# Altium schematic sheet spider.SchDoc
size A3; DrawnBy: Tor Brodtkorb; SheetNumber: 1; SheetTotal: 1; Email: strawberryhacker@outlook.com; Year: 2021; Github: https://github.com/strawberryhacker
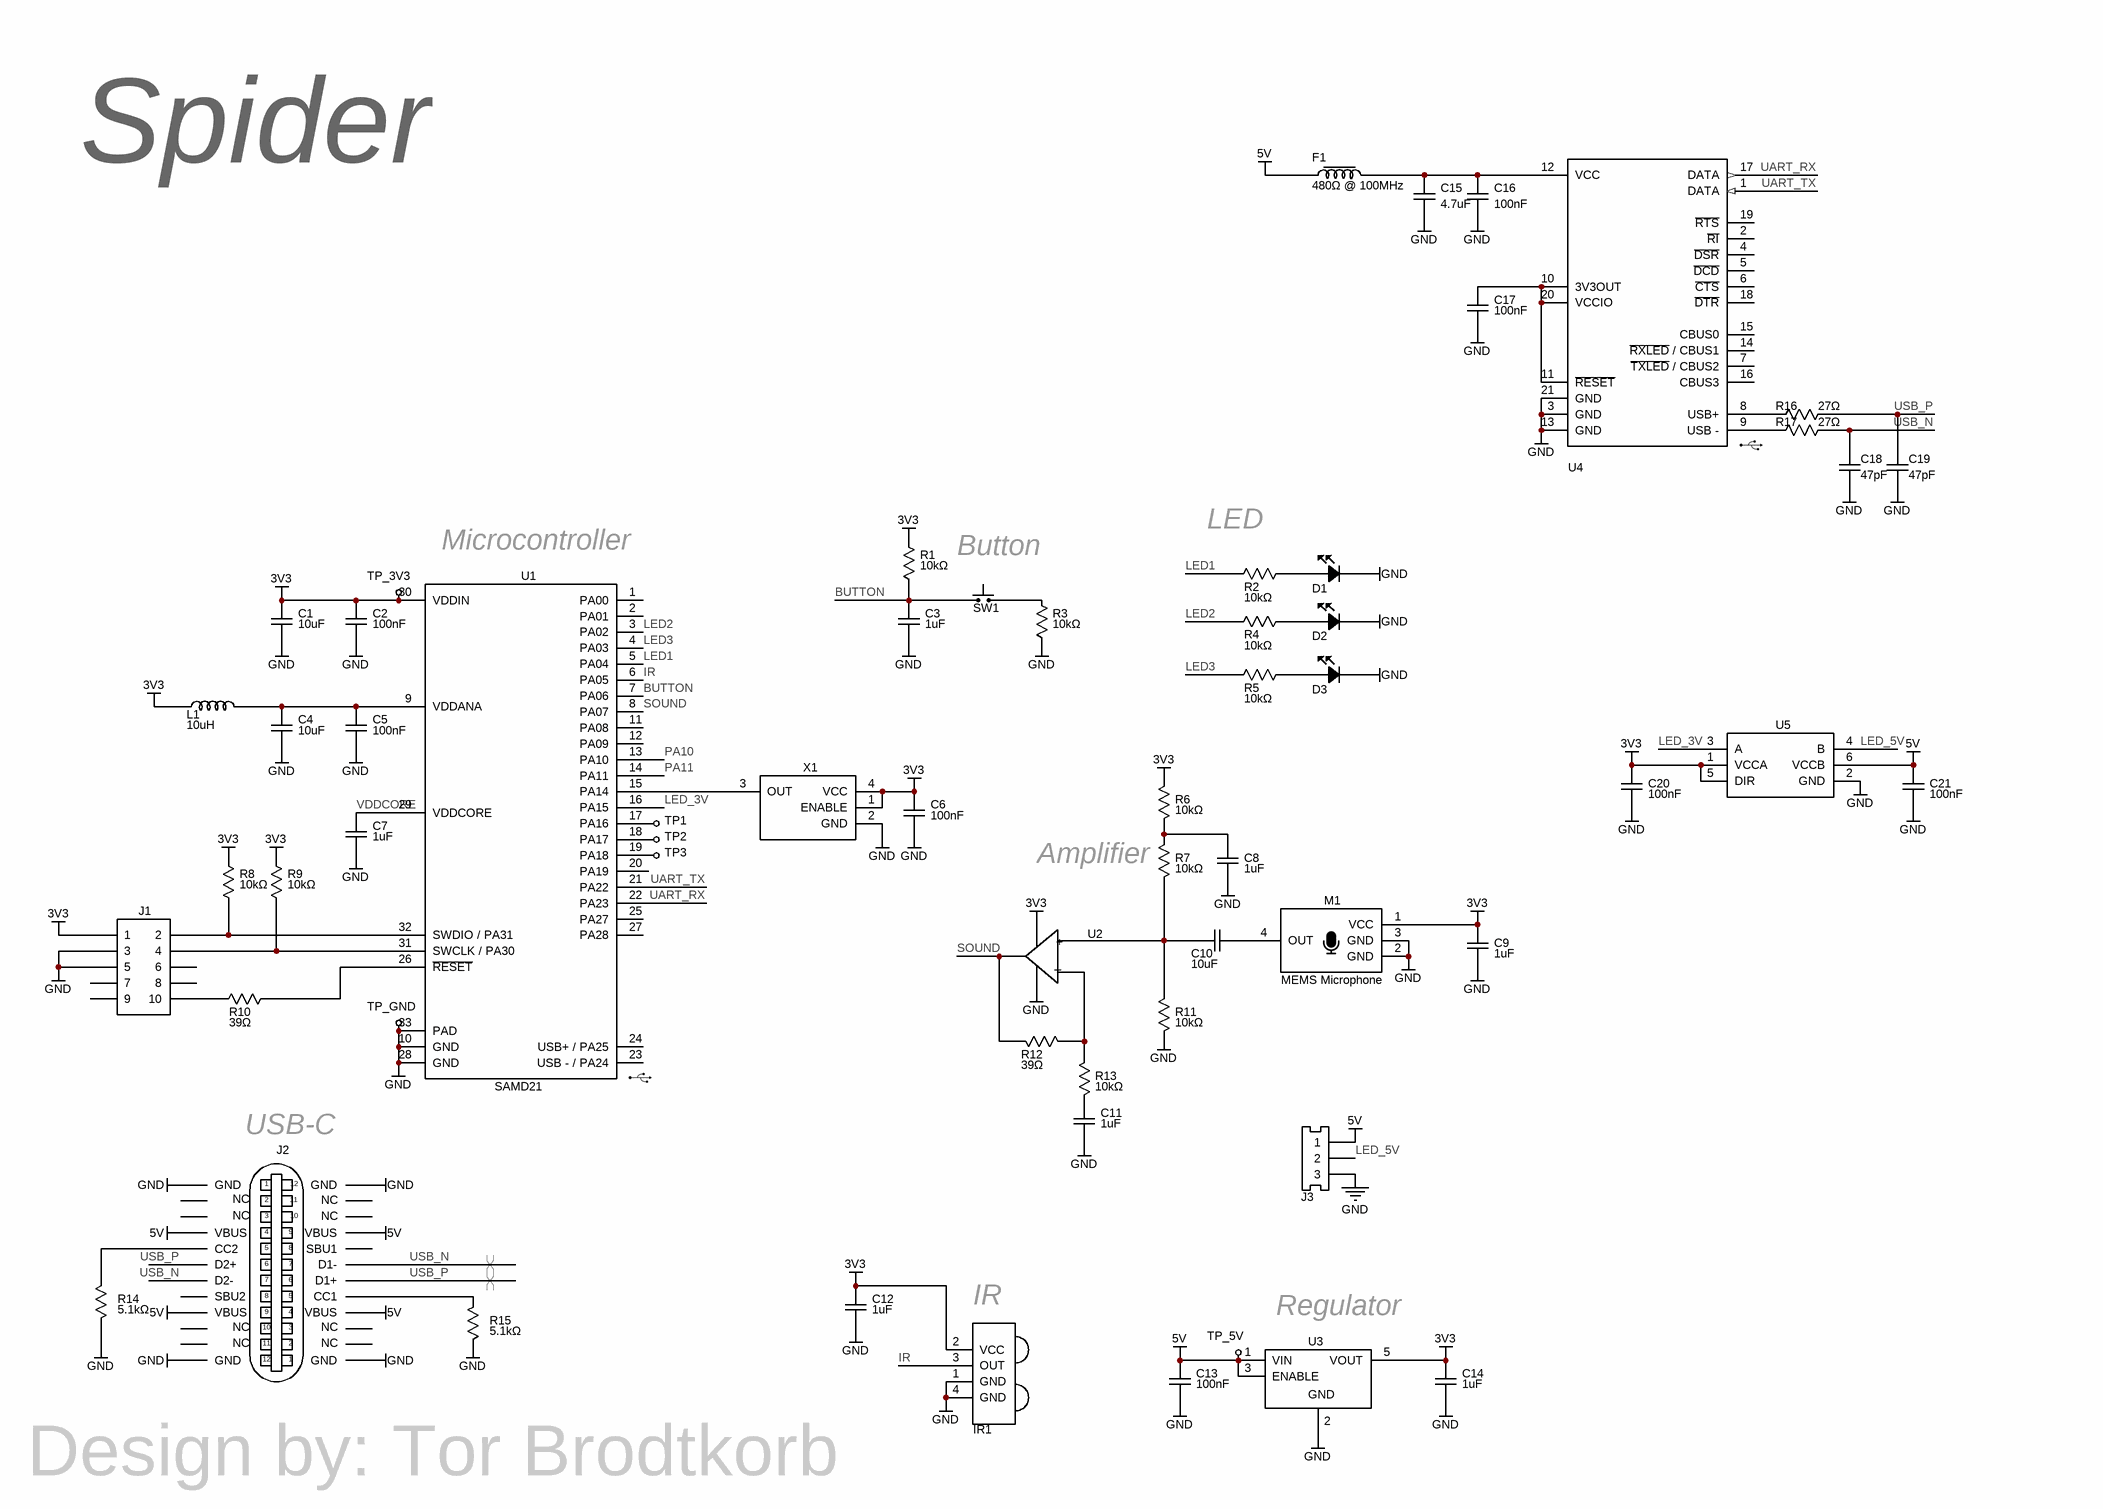
[diagram p0: spider.SchDoc]

## Parts
C1  value 10uF  [capacitor 0603]  (hidden comment: passive_5)
C2  value 100nF  [capacitor 0603]  (hidden comment: passive_5)
C3  value 1uF  [capacitor 0603]  (hidden comment: passive_5)
C4  value 10uF  [capacitor 0603]  (hidden comment: passive_5)
C5  value 100nF  [capacitor 0603]  (hidden comment: passive_5)
C6  value 100nF  [capacitor 0603]  (hidden comment: passive_5)
C7  value 1uF  [capacitor 0603]  (hidden comment: passive_5)
C8  value 1uF  [capacitor 0603]  (hidden comment: passive_5)
C9  value 1uF  [capacitor 0603]  (hidden comment: passive_5)
C10  value 10uF  [capacitor 0603]  (hidden comment: passive_5)
C11  value 1uF  [capacitor 0603]  (hidden comment: passive_5)
C12  value 1uF  [capacitor 0603]  (hidden comment: passive_5)
C13  value 100nF  [capacitor 0603]  (hidden comment: passive_5)
C14  value 1uF  [capacitor 0603]  (hidden comment: passive_5)
C15  value 4.7uF  [capacitor 0603]  (hidden comment: passive_5)
C16  value 100nF  [capacitor 0603]  (hidden comment: passive_5)
C17  value 100nF  [capacitor 0603]  (hidden comment: passive_5)
C18  value 47pF  [capacitor 0603]  (hidden comment: passive_5)
C19  value 47pF  [capacitor 0603]  (hidden comment: passive_5)
C20  value 100nF  [capacitor 0603]  (hidden comment: passive_5)
C21  value 100nF  [capacitor 0603]  (hidden comment: passive_5)
D1  LED White  [LED 0603 white]  (value not drawn)
D2  LED White  [LED 0603 white]  (value not drawn)
D3  LED White  [LED 0603 white]  (value not drawn)
F1  value 480Ω @ 100MHz  [ferrit bead 0603]  (hidden comment: passive_8)
IR1  sensor_1  [TSSP77038TR]  (value not drawn)
J1  Header 1.27mm  [header male 2x5, pitch 1.27mm]  (value not drawn)
J2  USB 2.0  [USB4105-GF-A]  (value not drawn)
J3  connector_41  [S3B-XH-A (LF)(SN)]  (value not drawn)
L1  value 10uH  [inductor 0603]  (hidden comment: passive_9)
M1  MEMS Microphone  [SPU0410HR5H-PB]
R1  value 10kΩ  [resistor 0603]  (hidden comment: passive_2)
R2  value 10kΩ  [resistor 0603]  (hidden comment: passive_2)
R3  value 10kΩ  [resistor 0603]  (hidden comment: passive_2)
R4  value 10kΩ  [resistor 0603]  (hidden comment: passive_2)
R5  value 10kΩ  [resistor 0603]  (hidden comment: passive_2)
R6  value 10kΩ  [resistor 0603]  (hidden comment: passive_2)
R7  value 10kΩ  [resistor 0603]  (hidden comment: passive_2)
R8  value 10kΩ  [resistor 0603]  (hidden comment: passive_2)
R9  value 10kΩ  [resistor 0603]  (hidden comment: passive_2)
R10  value 39Ω  [resistor 0603]  (hidden comment: passive_2)
R11  value 10kΩ  [resistor 0603]  (hidden comment: passive_2)
R12  value 39Ω  [resistor 0603]  (hidden comment: passive_2)
R13  value 10kΩ  [resistor 0603]  (hidden comment: passive_2)
R14  value 5.1kΩ  [resistor 0603]  (hidden comment: passive_2)
R15  value 5.1kΩ  [resistor 0603]  (hidden comment: passive_2)
R16  value 27Ω  [resistor 0603]  (hidden comment: passive_2)
R17  value 27Ω  [resistor 0603]  (hidden comment: passive_2)
SW1  connector_35  [KMR621NG LFS]  (value not drawn)
TP1  misc_3  [testpoint round, diameter 1.5mm]  (value not drawn)
TP2  misc_3  [testpoint round, diameter 1.5mm]  (value not drawn)
TP3  misc_3  [testpoint round, diameter 1.5mm]  (value not drawn)
TP_3V3  misc_3  [testpoint round, diameter 1.5mm]  (value not drawn)
TP_5V  misc_3  [testpoint round, diameter 1.5mm]  (value not drawn)
TP_GND  misc_3  [testpoint round, diameter 1.5mm]  (value not drawn)
U1  SAMD21  [ATSAMD21E17D-MUT]
U2  ic_6  [MCP6241T-E/OT]  (value not drawn)
U3  regulator_1  [TCR2EF33,LM(CT]  (value not drawn)
U4  FTDI  [FT231XQ-R]  (value not drawn)
U5  ic_10  [74LVC1T45Z6-7]  (value not drawn)
X1  8 MHz  [DSC6001CE2A-008.0000]  (value not drawn)

## Nets
3V3: C1.2 C2.2 C6.2 C9.2 C12.2 C14.2 C20.2 IR1.2(VCC) J1.1 L1.1 M1.1(VCC) R1.1 R6.2 R8.2 R9.2 TP_3V3.1 U1.30(VDDIN) U2.5 U3.5(VOUT) U5.1(VCCA) U5.5(DIR) X1.1(ENABLE) X1.4(VCC)
5V: C13.2 C21.2 F1.1 J2.A4_B9(VBUS) J2.B4_A9(VBUS) J3.1 TP_5V.1 U3.1(VIN) U3.3(ENABLE) U5.6(VCCB)
GND: C1.1 C2.1 C3.1 C4.1 C5.1 C6.1 C7.1 C8.1 C9.1 C11.1 C12.1 C13.1 C14.1 C15.1 C16.1 C17.1 C18.1 C19.1 C20.1 C21.1 D1.2 D2.2 D3.2 IR1.1(GND) IR1.4(GND) J1.3 J1.5 J2.A1_B12(GND) J2.B1_A12(GND) J3.3 M1.2(GND) M1.3(GND) R3.2 R11.1 R14.1 R15.1 TP_GND.1 U1.10(GND) U1.28(GND) U1.33(PAD) U2.2 U3.2 U4.3(GND) U4.13(GND) U4.21(GND) U5.2(GND) X1.2(GND)
BUTTON: C3.2 R1.2 SW1.1 U1.7(PA06)
IR: IR1.3(OUT) U1.6(PA05)
LED1: R2.2 U1.5(PA04)
LED2: R4.2 U1.3(PA02)
LED3: R5.2 U1.4(PA03)
LED_3V: U1.16(PA15) U5.3(A)
LED_5V: J3.2 U5.4(B)
PA10: U1.13(PA10)
PA11: U1.14(PA11)
SOUND: R12.2 U1.8(PA07) U2.1
UART_RX: U1.22(PA23) U4.17(DATA)
UART_TX: U1.21(PA22) U4.1(DATA)
USB_N: C18.2 J2.A7(D1-) J2.B7(D2-) R17.2
USB_P: C19.2 J2.A6(D1+) J2.B6(D2+) R16.2
VDDCORE: C7.2 U1.29(VDDCORE)
NetC4_2: C4.2 C5.2 L1.2 U1.9(VDDANA)
NetC8_2: C8.2 R6.1 R7.2
NetC10_1: C10.1 R7.1 R11.2 U2.3
NetC10_2: C10.2 M1.4(OUT)
NetC11_2: C11.2 R13.1
NetC15_2: C15.2 C16.2 F1.2 U4.12(VCC)
NetC17_2: C17.2 U4.10(3V3OUT) U4.11(~{RESET}) U4.20(VCCIO)
NetD1_1: D1.1 R2.1
NetD2_1: D2.1 R4.1
NetD3_1: D3.1 R5.1
NetJ1_2: J1.2 R8.1 U1.32(SWDIO_/_PA31)
NetJ1_4: J1.4 R9.1 U1.31(SWCLK_/_PA30)
NetJ1_10: J1.10 R10.1
NetJ2_A5: J2.A5(CC1) R15.2
NetJ2_B5: J2.B5(CC2) R14.2
NetR3_1: R3.1 SW1.2
NetR10_2: R10.2 U1.26(~{RESET})
NetR12_1: R12.1 R13.2 U2.4
NetR16_1: R16.1 U4.8(USB+)
NetR17_1: R17.1 U4.9(USB_-)
NetTP1_1: TP1.1 U1.17(PA16)
NetTP2_1: TP2.1 U1.18(PA17)
NetTP3_1: TP3.1 U1.19(PA18)
NetU1_15: U1.15(PA14) X1.3(OUT)

Not connected (* = marked no-connect by the designer): J1 6 7 8 9; J2 A8(SBU1) B8(SBU2); U1 1(PA00) 2(PA01) 11(PA08) 12(PA09) 20(PA19) 23(USB_-_/_PA24) 24(USB+_/_PA25) 25(PA27) 27(PA28); U4 2(~{RI}) 4(~{DSR}) 5(~{DCD}) 6(~{CTS}) 7(~{TXLED}_/_CBUS2) 14(~{RXLED}_/_CBUS1) 15(CBUS0) 16(CBUS3) 18(~{DTR}) 19(~{RTS})

## Layout directives
differential pair: USB_N, USB_P

## Notes on the sheet
- Spider
- Microcontroller
- Button
- (near R2) LED
- (near R7) Amplifier
- (near J2) USB-C
- (near IR1) IR
- Regulator
- (in symbol connector_35) 1; 12; NC; 2; 11; 3; 10; 4; 9; 5; 8; 6; 7
- (in symbol ic_6) +; _
- (in symbol regulator_1) GND

## Library data of the parts
C1-C21 = passive_5: Capacitor 0603
D1-D3 = diode_6: LED 0603 white
F1 = passive_8: Ferrite bead 0603
IR1 = sensor_1: IR receiver, 38 kHz, 40m, SMD; Manufacturer 1: Vishay Semiconductor Opto Division; Supplier 1: Digi-Key; Supplier Part Number 1: TSSP77038TRCT-ND; Manufacturer Part Number 1: TSSP77038TR
J1 = connector_17: Header male 2x5, pitch 1.27mm
J2 = connector_35: USB-C (2.0); Manufacturer 1: GCT; Supplier 1: Digi-Key; Supplier Part Number 1: 2073-USB4105-GF-ACT-ND; Manufacturer Part Number 1: USB4105-GF-A; Link: https://www.digikey.no/product-detail/no/gct/USB4105-GF-A/2073-USB4105-GF-ACT-ND/11198510
J3 = connector_41: JST connector 1x3, pitch 2.5mm, right angle, TH; Manufacturer 1: JST (JAPAN SOLDERLESS TERMINALS); Supplier 1: Farnell; Supplier Part Number 1: 1516290; Manufacturer Part Number 1: S3B-XH-A (LF)(SN); Link: https://no.farnell.com/jst-japan-solderless-terminals/s3b-xh-a-lf-sn/header-right-angle-3way/dp/1516290?st=jst
L1 = passive_9: Inductor 0603
M1 = sensor_2: Microphone, MEMS, 100 Hz - 10 kHz, 3.3V,  SMD; Manufacturer 1: Knowles; Supplier 1: Digi-Key; Supplier Part Number 1: 423-1138-1-ND; Manufacturer Part Number 1: SPU0410HR5H-PB
R1-R17 = passive_2: Resistor 0603
SW1 = connector_35: Tactile switch SMD, tiny; Manufacturer 1: C&K; Supplier 1: Digi-Key; Supplier Part Number 1: CKN10684CT-ND; Manufacturer Part Number 1: KMR621NG LFS; Link: https://www.digikey.no/product-detail/en/c-k/KMR621NG-LFS/CKN10684CT-ND/6035356
TP1-TP3 TP_3V3 TP_5V TP_GND = misc_3: Test-point round, diameter 1.5mm
U1 = cpu_0: SAMD21, 48 MHz, 128KB flash, 16KB RAM, 32 pins, USB device, QFN; Manufacturer 1: Microchip Technology; Supplier 1: Digi-Key; Supplier Part Number 1: ATSAMD21E17D-MUTTR-ND; Manufacturer Part Number 1: ATSAMD21E17D-MUT; Link: https://www.digikey.no/products/no?keywords=ATSAMD21E17D-MUTTR-ND
U2 = ic_6: OpAmp, 1 circuit, rail-to-rail, single supply, 1.8V to 5V, SOT23-5; Manufacturer 1: Microchip Technology; Supplier 1: Digi-Key; Supplier Part Number 1: MCP6241T-E/OTCT-ND; Manufacturer Part Number 1: MCP6241T-E/OT
U3 = regulator_1: LDO fixed, 3.3V output, 0.2V dropout, 200mA; Manufacturer 1: Toshiba Semiconductor and Storage; Supplier 1: Digi-Key; Supplier Part Number 1: TCR2EF33LM(CTCT-ND; Manufacturer Part Number 1: TCR2EF33,LM(CT; Output voltage: 3.3V; Dropout: 0.2V; Current: 200mA; Link: https://www.digikey.no/product-detail/en/toshiba-semiconductor-and-storage/TCR2EF33-LM-CT/TCR2EF33LM-CTCT-ND/4503328
U4 = ic_1: USB to UART converter, FTDI, single, 20 pins, QFN; Manufacturer 1: FTDI, Future Technology Devices International Ltd; Supplier 1: Digi-Key; Supplier Part Number 1: 768-1128-1-ND; Manufacturer Part Number 1: FT231XQ-R
U5 = ic_10: Level shifter, bidirectional, 1.65V - 5V, SOT-563; Manufacturer 1: Diodes Incorporated; Supplier 1: Digi-Key; Supplier Part Number 1: 74LVC1T45Z6-7DITR-ND; Manufacturer Part Number 1: 74LVC1T45Z6-7; Link: https://www.digikey.no/en/products/detail/diodes-incorporated/74LVC1T45Z6-7/4898825
X1 = oscillator_2: Oscillator, 8MHz, 3.3V, 3.2mm x 2.5mm; Manufacturer 1: Microchip Technology; Supplier 1: Digi-Key; Supplier Part Number 1: DSC6001CE2A-008.0000-ND; Manufacturer Part Number 1: DSC6001CE2A-008.0000; Link: https://www.digikey.com/en/products/detail/microchip-technology/DSC6001CE2A-008-0000/7732669